# EAGLE design Treiber_01 (EAGLE 9.1.1)
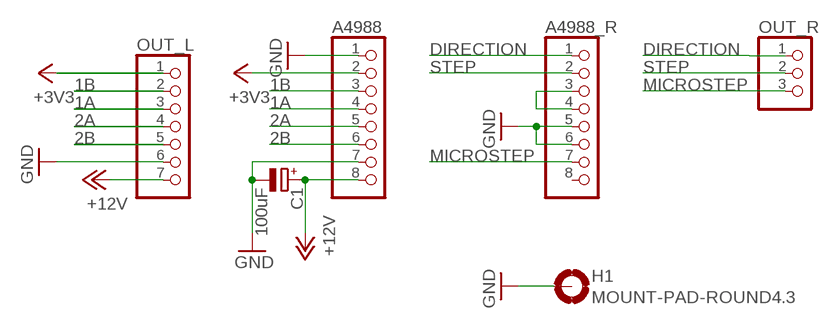
[diagram p0: schematic, sheet 1]

## Parts
A4988  PINHD-1X8  [1X08]
A4988_R  PINHD-1X8  [1X08]
C1  100uF  CPOL-EUE3.5-8  [E3,5-8]
H1  MOUNT-PAD-ROUND4.3  [4,3-PAD]
OUT_L  PINHD-1X7  [1X07]
OUT_R  PINHD-1X3  [1X03]

## Nets
1A: A4988.4 OUT_L.3
1B: A4988.3 OUT_L.2
2A: A4988.5 OUT_L.4
2B: A4988.6 OUT_L.5
+3V3: A4988.2 OUT_L.1
+12V: A4988.8 C1.+ OUT_L.7
DIRECTION: A4988_R.1 OUT_R.1
GND: A4988.1 A4988.7 A4988_R.5 A4988_R.6 C1.- H1.B4,3(MOUNT) OUT_L.6
MICROSTEP: A4988_R.7 OUT_R.3
N$11: A4988_R.3 A4988_R.4
STEP: A4988_R.2 OUT_R.2
Unconnected: A4988_R.8

## Library data of the parts
A4988 A4988_R = pinhead:PINHD-1X8: PIN HEADER
C1 = resistor:CPOL-EU: POLARIZED CAPACITOR, European symbol
H1 = holes:MOUNT-PAD-ROUND: MOUNTING PAD, round
OUT_L = pinhead:PINHD-1X7: PIN HEADER
OUT_R = pinhead:PINHD-1X3: PIN HEADER

## Net classes
1 GND: width 0.305 mm, clearance 0.305 mm

## Board
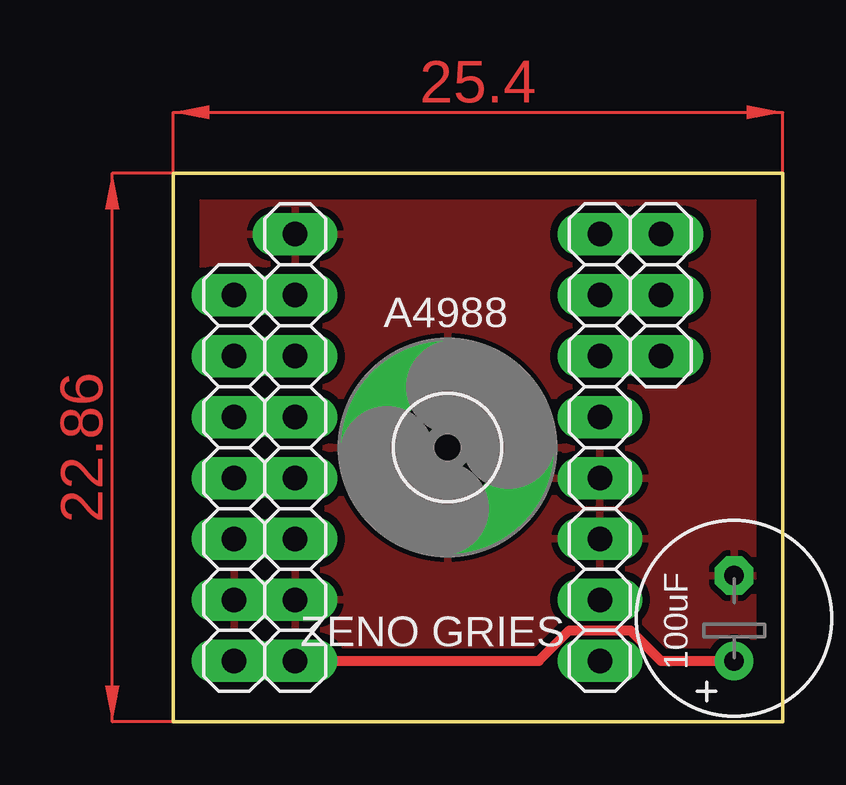
[diagram p1: board, top side]
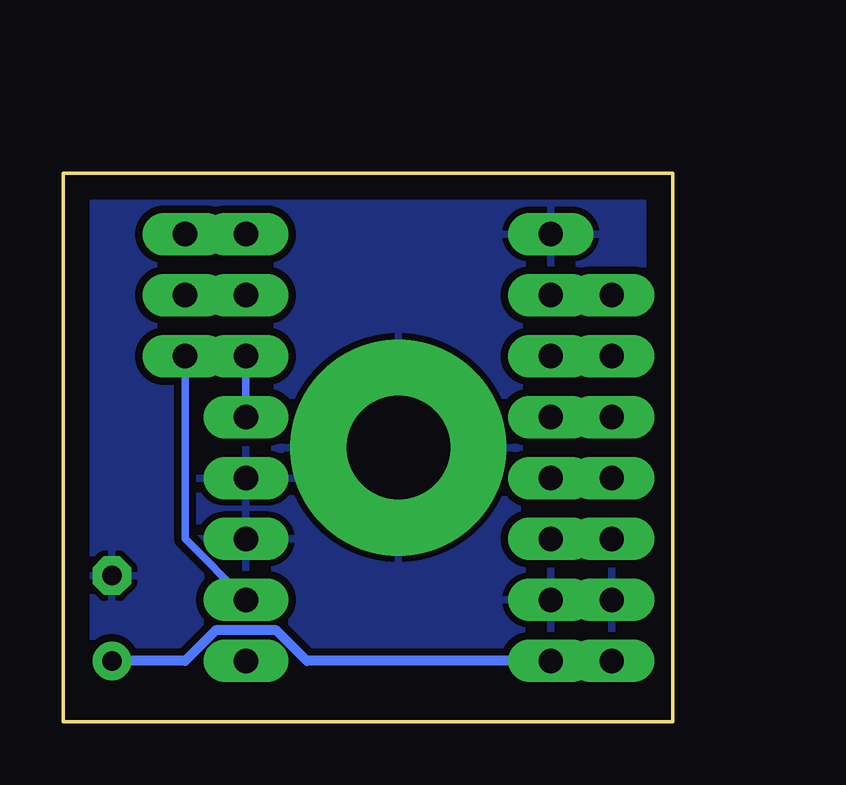
[diagram p2: board, bottom side, seen from below]

Size 25.4 x 22.86 mm. Coordinates in mm from the lower left corner, seen from the top.
Outline: 0,0 0,22.86 25.4,22.86 25.4,0 0,0
Copper layers (1*16): Top 0.035mm / dielectric 1.5mm / Bottom 0.035mm
Design rules "default *": minimum track width 6mil, minimum drill 0.35mm, track to track 6mil, track to pad 6mil, pad to pad 6mil, via to via 6mil, smd to smd 6mil, copper to edge 40mil, drill to drill 6mil, minimum pad ring 15mil, minimum via ring 8mil, stop-mask expansion 4mil, vias tented up to drill 0mil, thermal gap 10mil

### Footprints (pad centres in the part's own frame; a part is rotated, then mirrored left to right if it is on the bottom)
1X08 = drill 1.016 long: 1 -8.89,0; 2 -6.35,0; 3 -3.81,0; 4 -1.27,0; 5 1.27,0; 6 3.81,0; 7 6.35,0; 8 8.89,0
E3,5-8 = drill 0.813 pad 1.6: + -1.778,0 | drill 0.813 pad 1.6 octagon: - 1.778,0
4,3-PAD = drill 4.3 pad 9: B4,3 0,0
1X07 = drill 1.016 long: 1 -7.62,0; 2 -5.08,0; 3 -2.54,0; 4 0,0; 5 2.54,0; 6 5.08,0; 7 7.62,0
1X03 = drill 1.016 long: 1 -2.54,0; 2 0,0; 3 2.54,0

### Placement (x,y rotation side)
A4988  5.08,11.43 270 top
A4988_R  17.78,11.43 270 top
C1  23.37,4.32 90 top
H1  11.43,11.43 0 top
OUT_L  2.54,10.16 270 top
OUT_R  20.32,17.78 270 top

### Tracks (layer width: path | path; a pad name or v marks a point on that pad's centre or on a via)
1A
  Top 0.406: OUT_L.3 A4988.4
1B
  Top 0.406: OUT_L.2 A4988.3
2A
  Top 0.406: OUT_L.4 A4988.5
2B
  Top 0.406: OUT_L.5 A4988.6
+3V3
  Bottom 0.305: OUT_L.1 A4988.2
+12V
  Top 0.406: OUT_L.7 A4988.8 15.24,2.54 16.51,3.81 19.05,3.81 20.32,2.54 C1.+
  Bottom 0.406: A4988.8 15.24,2.54 16.51,3.81 19.05,3.81 20.32,2.54 C1.+
DIRECTION
  Bottom 0.305: A4988_R.1 OUT_R.1
GND
  pour Bottom (isolate 0.305): 0,22.86 0,0 25.4,0 25.4,22.86
  pour Top (isolate 0.305): 0,0 0,22.86 25.4,22.86 25.4,0
MICROSTEP
  Bottom 0.305: A4988_R.7 20.32,7.62 OUT_R.3
N$11
  Bottom 0.305: A4988_R.4 A4988_R.3
STEP
  Bottom 0.305: A4988_R.2 OUT_R.2
(copper drawn outside any net)
  shapes: Top area x2

### Text on the board
tPlace: ZENO GRIES